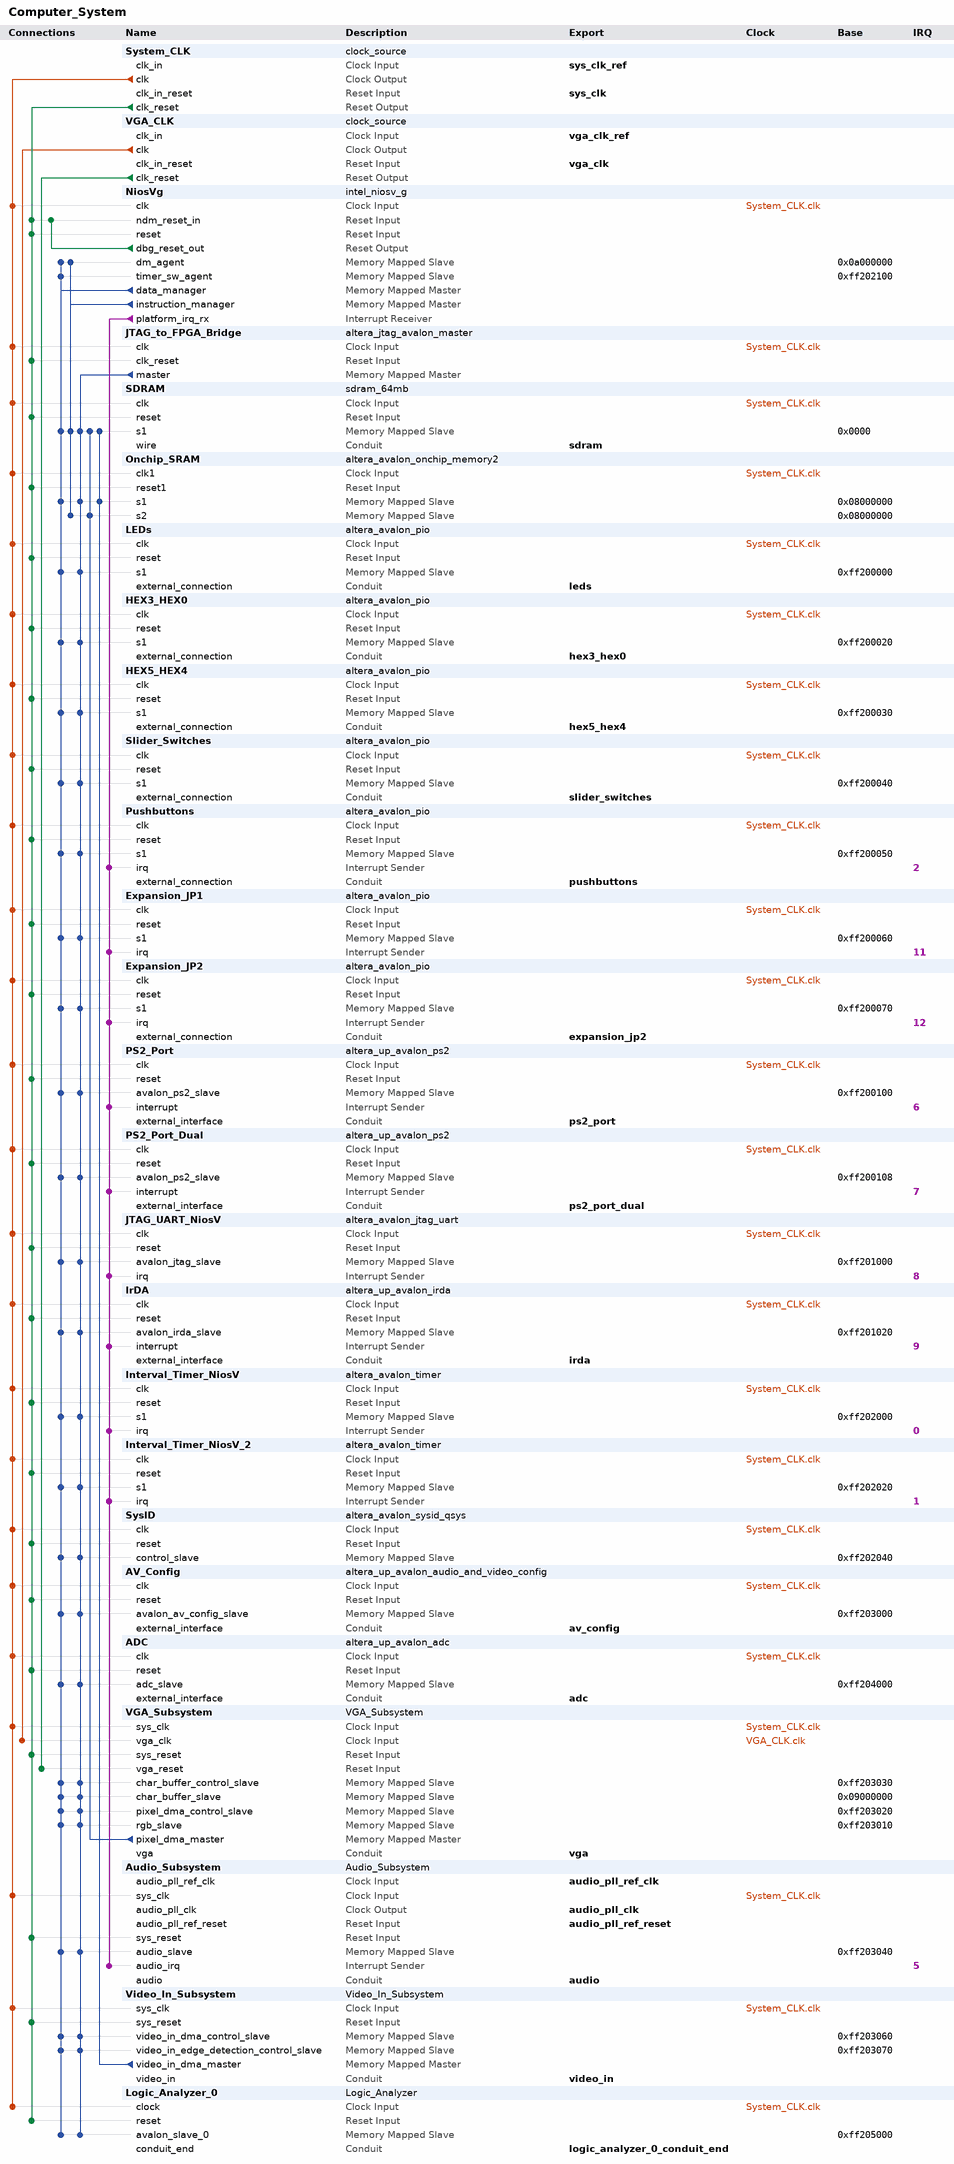
[diagram p0: system contents]
# Platform Designer (Qsys) system Computer_System, Cyclone V 5CSEMA5F31C6
# Parameters at their usual value, and those the tool derives, are not listed.
package require -exact qsys 24.1
create_system Computer_System
set_project_property DEVICE_FAMILY {Cyclone V}
set_project_property DEVICE 5CSEMA5F31C6

add_instance System_CLK clock_source 24.1
set_instance_parameter_value System_CLK clockFrequency 100000000

add_instance VGA_CLK clock_source 24.1
set_instance_parameter_value VGA_CLK clockFrequency 25000000

add_instance NiosVg intel_niosv_g 4.0.0
set_instance_parameter_value NiosVg Blind_Window_Period 1000
set_instance_parameter_value NiosVg CLICenabledInterruptMode 0
set_instance_parameter_value NiosVg CLICenabledShadowRegisterFiles 1
set_instance_parameter_value NiosVg Default_Timeout_Period 255
set_instance_parameter_value NiosVg alignCLICVectorTable 8
set_instance_parameter_value NiosVg basicInterruptMode 0
set_instance_parameter_value NiosVg basicShadowRegisterFiles 0
set_instance_parameter_value NiosVg clockFrequency 100000000
set_instance_parameter_value NiosVg dataCacheSize 1024
set_instance_parameter_value NiosVg disableFsqrtFdiv false
set_instance_parameter_value NiosVg dtcm1Base 0
set_instance_parameter_value NiosVg dtcm1Size 0
set_instance_parameter_value NiosVg dtcm2Base 0
set_instance_parameter_value NiosVg dtcm2Size 0
set_instance_parameter_value NiosVg enableBranchPrediction true
set_instance_parameter_value NiosVg enableCLICInterruptEdgeTriggerConfig false
set_instance_parameter_value NiosVg enableCLICInterruptPolarityConfig false
set_instance_parameter_value NiosVg enableCLICSelectiveHardwareVectoring false
set_instance_parameter_value NiosVg enableCoreLevelInterruptController false
set_instance_parameter_value NiosVg enableDebug true
set_instance_parameter_value NiosVg enableDebugReset true
set_instance_parameter_value NiosVg enableECCFull false
set_instance_parameter_value NiosVg enableECCLite false
set_instance_parameter_value NiosVg enableFPU true
set_instance_parameter_value NiosVg enableLockstep false
set_instance_parameter_value NiosVg enableLockstepExtRst false
set_instance_parameter_value NiosVg enableMulDiv true
set_instance_parameter_value NiosVg hartId 0
set_instance_parameter_value NiosVg instCacheSize 1024
set_instance_parameter_value NiosVg itcm1Base 0
set_instance_parameter_value NiosVg itcm1Size 0
set_instance_parameter_value NiosVg itcm2Base 0
set_instance_parameter_value NiosVg itcm2Size 0
set_instance_parameter_value NiosVg numCLICDebugTriggers 0
set_instance_parameter_value NiosVg numCLICLevels 2
set_instance_parameter_value NiosVg numCLICPlatformInterrupts 16
set_instance_parameter_value NiosVg numCLICPriorities 8
set_instance_parameter_value NiosVg peripheralRegionABase -16777216
set_instance_parameter_value NiosVg peripheralRegionASize 16777216
set_instance_parameter_value NiosVg peripheralRegionBBase 134217728
set_instance_parameter_value NiosVg peripheralRegionBSize 134217728
set_instance_parameter_value NiosVg resetOffset 0
set_instance_parameter_value NiosVg resetSlave Absolute
set_instance_parameter_value NiosVg useResetReq false

add_instance JTAG_to_FPGA_Bridge altera_jtag_avalon_master 24.1

add_instance SDRAM sdram_64mb 1.0

add_instance Onchip_SRAM altera_avalon_onchip_memory2 24.1
set_instance_parameter_value Onchip_SRAM dataWidth 32
set_instance_parameter_value Onchip_SRAM dualPort true
set_instance_parameter_value Onchip_SRAM initMemContent true
set_instance_parameter_value Onchip_SRAM initializationFileName onchip_mem.hex
set_instance_parameter_value Onchip_SRAM memorySize 262144
set_instance_parameter_value Onchip_SRAM singleClockOperation true

add_instance LEDs altera_avalon_pio 24.1
set_instance_parameter_value LEDs direction Output
set_instance_parameter_value LEDs width 10

add_instance HEX3_HEX0 altera_avalon_pio 24.1
set_instance_parameter_value HEX3_HEX0 direction Output
set_instance_parameter_value HEX3_HEX0 width 32

add_instance HEX5_HEX4 altera_avalon_pio 24.1
set_instance_parameter_value HEX5_HEX4 direction Output
set_instance_parameter_value HEX5_HEX4 width 16

add_instance Slider_Switches altera_avalon_pio 24.1
set_instance_parameter_value Slider_Switches direction Input
set_instance_parameter_value Slider_Switches simDoTestBenchWiring true
set_instance_parameter_value Slider_Switches width 10

add_instance Pushbuttons altera_avalon_pio 24.1
set_instance_parameter_value Pushbuttons bitClearingEdgeCapReg true
set_instance_parameter_value Pushbuttons captureEdge true
set_instance_parameter_value Pushbuttons direction Input
set_instance_parameter_value Pushbuttons edgeType FALLING
set_instance_parameter_value Pushbuttons generateIRQ true
set_instance_parameter_value Pushbuttons irqType EDGE
set_instance_parameter_value Pushbuttons simDoTestBenchWiring true
set_instance_parameter_value Pushbuttons width 4

add_instance Expansion_JP1 altera_avalon_pio 24.1
set_instance_parameter_value Expansion_JP1 bitClearingEdgeCapReg true
set_instance_parameter_value Expansion_JP1 captureEdge true
set_instance_parameter_value Expansion_JP1 direction Bidir
set_instance_parameter_value Expansion_JP1 edgeType FALLING
set_instance_parameter_value Expansion_JP1 generateIRQ true
set_instance_parameter_value Expansion_JP1 irqType EDGE
set_instance_parameter_value Expansion_JP1 simDoTestBenchWiring true
set_instance_parameter_value Expansion_JP1 width 32

add_instance Expansion_JP2 altera_avalon_pio 24.1
set_instance_parameter_value Expansion_JP2 bitClearingEdgeCapReg true
set_instance_parameter_value Expansion_JP2 captureEdge true
set_instance_parameter_value Expansion_JP2 direction Bidir
set_instance_parameter_value Expansion_JP2 edgeType FALLING
set_instance_parameter_value Expansion_JP2 generateIRQ true
set_instance_parameter_value Expansion_JP2 irqType EDGE
set_instance_parameter_value Expansion_JP2 simDoTestBenchWiring true
set_instance_parameter_value Expansion_JP2 width 32

add_instance PS2_Port altera_up_avalon_ps2 18.0

add_instance PS2_Port_Dual altera_up_avalon_ps2 18.0

add_instance JTAG_UART_NiosV altera_avalon_jtag_uart 24.1
set_instance_parameter_value JTAG_UART_NiosV simInteractiveOptions NO_INTERACTIVE_WINDOWS

add_instance IrDA altera_up_avalon_irda 18.0
set_instance_parameter_value IrDA baud 115200
set_instance_parameter_value IrDA parity None

add_instance Interval_Timer_NiosV altera_avalon_timer 24.1
set_instance_parameter_value Interval_Timer_NiosV period 125.0
set_instance_parameter_value Interval_Timer_NiosV periodUnits MSEC

add_instance Interval_Timer_NiosV_2 altera_avalon_timer 24.1
set_instance_parameter_value Interval_Timer_NiosV_2 period 125.0
set_instance_parameter_value Interval_Timer_NiosV_2 periodUnits MSEC

add_instance SysID altera_avalon_sysid_qsys 24.1
set_instance_parameter_value SysID id 0

add_instance AV_Config altera_up_avalon_audio_and_video_config 18.0
set_instance_parameter_value AV_Config audio_in {Microphone to ADC}
set_instance_parameter_value AV_Config bit_length 32
set_instance_parameter_value AV_Config board DE1-SoC
set_instance_parameter_value AV_Config line_in_bypass true
set_instance_parameter_value AV_Config sampling_rate {8 kHz}

add_instance ADC altera_up_avalon_adc 18.0
set_instance_parameter_value ADC board DE1-SoC
set_instance_parameter_value ADC numch_ 8

add_instance VGA_Subsystem VGA_Subsystem 1.0

add_instance Audio_Subsystem Audio_Subsystem 1.0

add_instance Video_In_Subsystem Video_In_Subsystem 1.0

add_instance Logic_Analyzer_0 Logic_Analyzer 1.0

# connections
add_connection System_CLK.clk ADC.clk clock
add_connection System_CLK.clk Audio_Subsystem.sys_clk clock
add_connection System_CLK.clk AV_Config.clk clock
add_connection System_CLK.clk Expansion_JP1.clk clock
add_connection System_CLK.clk Expansion_JP2.clk clock
add_connection System_CLK.clk HEX3_HEX0.clk clock
add_connection System_CLK.clk HEX5_HEX4.clk clock
add_connection System_CLK.clk Interval_Timer_NiosV.clk clock
add_connection System_CLK.clk Interval_Timer_NiosV_2.clk clock
add_connection System_CLK.clk IrDA.clk clock
add_connection System_CLK.clk JTAG_to_FPGA_Bridge.clk clock
add_connection System_CLK.clk JTAG_UART_NiosV.clk clock
add_connection System_CLK.clk LEDs.clk clock
add_connection System_CLK.clk Logic_Analyzer_0.clock clock
add_connection System_CLK.clk NiosVg.clk clock
add_connection System_CLK.clk Onchip_SRAM.clk1 clock
add_connection System_CLK.clk PS2_Port.clk clock
add_connection System_CLK.clk PS2_Port_Dual.clk clock
add_connection System_CLK.clk Pushbuttons.clk clock
add_connection System_CLK.clk SDRAM.clk clock
add_connection System_CLK.clk Slider_Switches.clk clock
add_connection System_CLK.clk SysID.clk clock
add_connection System_CLK.clk VGA_Subsystem.sys_clk clock
add_connection System_CLK.clk Video_In_Subsystem.sys_clk clock
add_connection VGA_CLK.clk VGA_Subsystem.vga_clk clock
add_connection NiosVg.dbg_reset_out NiosVg.ndm_reset_in reset
add_connection System_CLK.clk_reset ADC.reset reset
add_connection System_CLK.clk_reset Audio_Subsystem.sys_reset reset
add_connection System_CLK.clk_reset AV_Config.reset reset
add_connection System_CLK.clk_reset Expansion_JP1.reset reset
add_connection System_CLK.clk_reset Expansion_JP2.reset reset
add_connection System_CLK.clk_reset HEX3_HEX0.reset reset
add_connection System_CLK.clk_reset HEX5_HEX4.reset reset
add_connection System_CLK.clk_reset Interval_Timer_NiosV.reset reset
add_connection System_CLK.clk_reset Interval_Timer_NiosV_2.reset reset
add_connection System_CLK.clk_reset IrDA.reset reset
add_connection System_CLK.clk_reset JTAG_to_FPGA_Bridge.clk_reset reset
add_connection System_CLK.clk_reset JTAG_UART_NiosV.reset reset
add_connection System_CLK.clk_reset LEDs.reset reset
add_connection System_CLK.clk_reset Logic_Analyzer_0.reset reset
add_connection System_CLK.clk_reset NiosVg.ndm_reset_in reset
add_connection System_CLK.clk_reset NiosVg.reset reset
add_connection System_CLK.clk_reset Onchip_SRAM.reset1 reset
add_connection System_CLK.clk_reset PS2_Port.reset reset
add_connection System_CLK.clk_reset PS2_Port_Dual.reset reset
add_connection System_CLK.clk_reset Pushbuttons.reset reset
add_connection System_CLK.clk_reset SDRAM.reset reset
add_connection System_CLK.clk_reset Slider_Switches.reset reset
add_connection System_CLK.clk_reset SysID.reset reset
add_connection System_CLK.clk_reset VGA_Subsystem.sys_reset reset
add_connection System_CLK.clk_reset Video_In_Subsystem.sys_reset reset
add_connection VGA_CLK.clk_reset VGA_Subsystem.vga_reset reset
add_connection JTAG_to_FPGA_Bridge.master ADC.adc_slave avalon
set_connection_parameter_value JTAG_to_FPGA_Bridge.master/ADC.adc_slave baseAddress 0xff204000
add_connection JTAG_to_FPGA_Bridge.master Audio_Subsystem.audio_slave avalon
set_connection_parameter_value JTAG_to_FPGA_Bridge.master/Audio_Subsystem.audio_slave baseAddress 0xff203040
add_connection JTAG_to_FPGA_Bridge.master AV_Config.avalon_av_config_slave avalon
set_connection_parameter_value JTAG_to_FPGA_Bridge.master/AV_Config.avalon_av_config_slave baseAddress 0xff203000
add_connection JTAG_to_FPGA_Bridge.master Expansion_JP1.s1 avalon
set_connection_parameter_value JTAG_to_FPGA_Bridge.master/Expansion_JP1.s1 baseAddress 0xff200060
add_connection JTAG_to_FPGA_Bridge.master Expansion_JP2.s1 avalon
set_connection_parameter_value JTAG_to_FPGA_Bridge.master/Expansion_JP2.s1 baseAddress 0xff200070
add_connection JTAG_to_FPGA_Bridge.master HEX3_HEX0.s1 avalon
set_connection_parameter_value JTAG_to_FPGA_Bridge.master/HEX3_HEX0.s1 baseAddress 0xff200020
add_connection JTAG_to_FPGA_Bridge.master HEX5_HEX4.s1 avalon
set_connection_parameter_value JTAG_to_FPGA_Bridge.master/HEX5_HEX4.s1 baseAddress 0xff200030
add_connection JTAG_to_FPGA_Bridge.master Interval_Timer_NiosV.s1 avalon
set_connection_parameter_value JTAG_to_FPGA_Bridge.master/Interval_Timer_NiosV.s1 baseAddress 0xff202000
add_connection JTAG_to_FPGA_Bridge.master Interval_Timer_NiosV_2.s1 avalon
set_connection_parameter_value JTAG_to_FPGA_Bridge.master/Interval_Timer_NiosV_2.s1 baseAddress 0xff202020
add_connection JTAG_to_FPGA_Bridge.master IrDA.avalon_irda_slave avalon
set_connection_parameter_value JTAG_to_FPGA_Bridge.master/IrDA.avalon_irda_slave baseAddress 0xff201020
add_connection JTAG_to_FPGA_Bridge.master JTAG_UART_NiosV.avalon_jtag_slave avalon
set_connection_parameter_value JTAG_to_FPGA_Bridge.master/JTAG_UART_NiosV.avalon_jtag_slave baseAddress 0xff201000
add_connection JTAG_to_FPGA_Bridge.master LEDs.s1 avalon
set_connection_parameter_value JTAG_to_FPGA_Bridge.master/LEDs.s1 baseAddress 0xff200000
add_connection JTAG_to_FPGA_Bridge.master Logic_Analyzer_0.avalon_slave_0 avalon
set_connection_parameter_value JTAG_to_FPGA_Bridge.master/Logic_Analyzer_0.avalon_slave_0 baseAddress 0xff205000
add_connection JTAG_to_FPGA_Bridge.master Onchip_SRAM.s1 avalon
set_connection_parameter_value JTAG_to_FPGA_Bridge.master/Onchip_SRAM.s1 baseAddress 0x08000000
add_connection JTAG_to_FPGA_Bridge.master PS2_Port.avalon_ps2_slave avalon
set_connection_parameter_value JTAG_to_FPGA_Bridge.master/PS2_Port.avalon_ps2_slave baseAddress 0xff200100
add_connection JTAG_to_FPGA_Bridge.master PS2_Port_Dual.avalon_ps2_slave avalon
set_connection_parameter_value JTAG_to_FPGA_Bridge.master/PS2_Port_Dual.avalon_ps2_slave baseAddress 0xff200108
add_connection JTAG_to_FPGA_Bridge.master Pushbuttons.s1 avalon
set_connection_parameter_value JTAG_to_FPGA_Bridge.master/Pushbuttons.s1 baseAddress 0xff200050
add_connection JTAG_to_FPGA_Bridge.master SDRAM.s1 avalon
set_connection_parameter_value JTAG_to_FPGA_Bridge.master/SDRAM.s1 baseAddress 0x0000
add_connection JTAG_to_FPGA_Bridge.master Slider_Switches.s1 avalon
set_connection_parameter_value JTAG_to_FPGA_Bridge.master/Slider_Switches.s1 baseAddress 0xff200040
add_connection JTAG_to_FPGA_Bridge.master SysID.control_slave avalon
set_connection_parameter_value JTAG_to_FPGA_Bridge.master/SysID.control_slave baseAddress 0xff202040
add_connection JTAG_to_FPGA_Bridge.master VGA_Subsystem.char_buffer_control_slave avalon
set_connection_parameter_value JTAG_to_FPGA_Bridge.master/VGA_Subsystem.char_buffer_control_slave baseAddress 0xff203030
add_connection JTAG_to_FPGA_Bridge.master VGA_Subsystem.char_buffer_slave avalon
set_connection_parameter_value JTAG_to_FPGA_Bridge.master/VGA_Subsystem.char_buffer_slave baseAddress 0x09000000
add_connection JTAG_to_FPGA_Bridge.master VGA_Subsystem.pixel_dma_control_slave avalon
set_connection_parameter_value JTAG_to_FPGA_Bridge.master/VGA_Subsystem.pixel_dma_control_slave baseAddress 0xff203020
add_connection JTAG_to_FPGA_Bridge.master VGA_Subsystem.rgb_slave avalon
set_connection_parameter_value JTAG_to_FPGA_Bridge.master/VGA_Subsystem.rgb_slave baseAddress 0xff203010
add_connection JTAG_to_FPGA_Bridge.master Video_In_Subsystem.video_in_dma_control_slave avalon
set_connection_parameter_value JTAG_to_FPGA_Bridge.master/Video_In_Subsystem.video_in_dma_control_slave baseAddress 0xff203060
add_connection JTAG_to_FPGA_Bridge.master Video_In_Subsystem.video_in_edge_detection_control_slave avalon
set_connection_parameter_value JTAG_to_FPGA_Bridge.master/Video_In_Subsystem.video_in_edge_detection_control_slave baseAddress 0xff203070
add_connection NiosVg.data_manager ADC.adc_slave avalon
set_connection_parameter_value NiosVg.data_manager/ADC.adc_slave baseAddress 0xff204000
add_connection NiosVg.data_manager Audio_Subsystem.audio_slave avalon
set_connection_parameter_value NiosVg.data_manager/Audio_Subsystem.audio_slave baseAddress 0xff203040
add_connection NiosVg.data_manager AV_Config.avalon_av_config_slave avalon
set_connection_parameter_value NiosVg.data_manager/AV_Config.avalon_av_config_slave baseAddress 0xff203000
add_connection NiosVg.data_manager Expansion_JP1.s1 avalon
set_connection_parameter_value NiosVg.data_manager/Expansion_JP1.s1 baseAddress 0xff200060
add_connection NiosVg.data_manager Expansion_JP2.s1 avalon
set_connection_parameter_value NiosVg.data_manager/Expansion_JP2.s1 baseAddress 0xff200070
add_connection NiosVg.data_manager HEX3_HEX0.s1 avalon
set_connection_parameter_value NiosVg.data_manager/HEX3_HEX0.s1 baseAddress 0xff200020
add_connection NiosVg.data_manager HEX5_HEX4.s1 avalon
set_connection_parameter_value NiosVg.data_manager/HEX5_HEX4.s1 baseAddress 0xff200030
add_connection NiosVg.data_manager Interval_Timer_NiosV.s1 avalon
set_connection_parameter_value NiosVg.data_manager/Interval_Timer_NiosV.s1 baseAddress 0xff202000
add_connection NiosVg.data_manager Interval_Timer_NiosV_2.s1 avalon
set_connection_parameter_value NiosVg.data_manager/Interval_Timer_NiosV_2.s1 baseAddress 0xff202020
add_connection NiosVg.data_manager IrDA.avalon_irda_slave avalon
set_connection_parameter_value NiosVg.data_manager/IrDA.avalon_irda_slave baseAddress 0xff201020
add_connection NiosVg.data_manager JTAG_UART_NiosV.avalon_jtag_slave avalon
set_connection_parameter_value NiosVg.data_manager/JTAG_UART_NiosV.avalon_jtag_slave baseAddress 0xff201000
add_connection NiosVg.data_manager LEDs.s1 avalon
set_connection_parameter_value NiosVg.data_manager/LEDs.s1 baseAddress 0xff200000
add_connection NiosVg.data_manager Logic_Analyzer_0.avalon_slave_0 avalon
set_connection_parameter_value NiosVg.data_manager/Logic_Analyzer_0.avalon_slave_0 baseAddress 0xff205000
add_connection NiosVg.data_manager NiosVg.dm_agent avalon
set_connection_parameter_value NiosVg.data_manager/NiosVg.dm_agent baseAddress 0x0a000000
add_connection NiosVg.data_manager NiosVg.timer_sw_agent avalon
set_connection_parameter_value NiosVg.data_manager/NiosVg.timer_sw_agent baseAddress 0xff202100
add_connection NiosVg.data_manager Onchip_SRAM.s1 avalon
set_connection_parameter_value NiosVg.data_manager/Onchip_SRAM.s1 baseAddress 0x08000000
add_connection NiosVg.data_manager PS2_Port.avalon_ps2_slave avalon
set_connection_parameter_value NiosVg.data_manager/PS2_Port.avalon_ps2_slave baseAddress 0xff200100
add_connection NiosVg.data_manager PS2_Port_Dual.avalon_ps2_slave avalon
set_connection_parameter_value NiosVg.data_manager/PS2_Port_Dual.avalon_ps2_slave baseAddress 0xff200108
add_connection NiosVg.data_manager Pushbuttons.s1 avalon
set_connection_parameter_value NiosVg.data_manager/Pushbuttons.s1 baseAddress 0xff200050
add_connection NiosVg.data_manager SDRAM.s1 avalon
set_connection_parameter_value NiosVg.data_manager/SDRAM.s1 baseAddress 0x0000
add_connection NiosVg.data_manager Slider_Switches.s1 avalon
set_connection_parameter_value NiosVg.data_manager/Slider_Switches.s1 baseAddress 0xff200040
add_connection NiosVg.data_manager SysID.control_slave avalon
set_connection_parameter_value NiosVg.data_manager/SysID.control_slave baseAddress 0xff202040
add_connection NiosVg.data_manager VGA_Subsystem.char_buffer_control_slave avalon
set_connection_parameter_value NiosVg.data_manager/VGA_Subsystem.char_buffer_control_slave baseAddress 0xff203030
add_connection NiosVg.data_manager VGA_Subsystem.char_buffer_slave avalon
set_connection_parameter_value NiosVg.data_manager/VGA_Subsystem.char_buffer_slave baseAddress 0x09000000
add_connection NiosVg.data_manager VGA_Subsystem.pixel_dma_control_slave avalon
set_connection_parameter_value NiosVg.data_manager/VGA_Subsystem.pixel_dma_control_slave baseAddress 0xff203020
add_connection NiosVg.data_manager VGA_Subsystem.rgb_slave avalon
set_connection_parameter_value NiosVg.data_manager/VGA_Subsystem.rgb_slave baseAddress 0xff203010
add_connection NiosVg.data_manager Video_In_Subsystem.video_in_dma_control_slave avalon
set_connection_parameter_value NiosVg.data_manager/Video_In_Subsystem.video_in_dma_control_slave baseAddress 0xff203060
add_connection NiosVg.data_manager Video_In_Subsystem.video_in_edge_detection_control_slave avalon
set_connection_parameter_value NiosVg.data_manager/Video_In_Subsystem.video_in_edge_detection_control_slave baseAddress 0xff203070
add_connection NiosVg.instruction_manager NiosVg.dm_agent avalon
set_connection_parameter_value NiosVg.instruction_manager/NiosVg.dm_agent baseAddress 0x0a000000
add_connection NiosVg.instruction_manager Onchip_SRAM.s2 avalon
set_connection_parameter_value NiosVg.instruction_manager/Onchip_SRAM.s2 baseAddress 0x08000000
add_connection NiosVg.instruction_manager SDRAM.s1 avalon
set_connection_parameter_value NiosVg.instruction_manager/SDRAM.s1 baseAddress 0x0000
add_connection VGA_Subsystem.pixel_dma_master Onchip_SRAM.s2 avalon
set_connection_parameter_value VGA_Subsystem.pixel_dma_master/Onchip_SRAM.s2 baseAddress 0x08000000
add_connection VGA_Subsystem.pixel_dma_master SDRAM.s1 avalon
set_connection_parameter_value VGA_Subsystem.pixel_dma_master/SDRAM.s1 baseAddress 0x0000
add_connection Video_In_Subsystem.video_in_dma_master Onchip_SRAM.s1 avalon
set_connection_parameter_value Video_In_Subsystem.video_in_dma_master/Onchip_SRAM.s1 baseAddress 0x08000000
add_connection Video_In_Subsystem.video_in_dma_master SDRAM.s1 avalon
set_connection_parameter_value Video_In_Subsystem.video_in_dma_master/SDRAM.s1 baseAddress 0x0000
add_connection NiosVg.platform_irq_rx Audio_Subsystem.audio_irq interrupt
set_connection_parameter_value NiosVg.platform_irq_rx/Audio_Subsystem.audio_irq irqNumber 5
add_connection NiosVg.platform_irq_rx Expansion_JP1.irq interrupt
set_connection_parameter_value NiosVg.platform_irq_rx/Expansion_JP1.irq irqNumber 11
add_connection NiosVg.platform_irq_rx Expansion_JP2.irq interrupt
set_connection_parameter_value NiosVg.platform_irq_rx/Expansion_JP2.irq irqNumber 12
add_connection NiosVg.platform_irq_rx Interval_Timer_NiosV.irq interrupt
set_connection_parameter_value NiosVg.platform_irq_rx/Interval_Timer_NiosV.irq irqNumber 0
add_connection NiosVg.platform_irq_rx Interval_Timer_NiosV_2.irq interrupt
set_connection_parameter_value NiosVg.platform_irq_rx/Interval_Timer_NiosV_2.irq irqNumber 1
add_connection NiosVg.platform_irq_rx IrDA.interrupt interrupt
set_connection_parameter_value NiosVg.platform_irq_rx/IrDA.interrupt irqNumber 9
add_connection NiosVg.platform_irq_rx JTAG_UART_NiosV.irq interrupt
set_connection_parameter_value NiosVg.platform_irq_rx/JTAG_UART_NiosV.irq irqNumber 8
add_connection NiosVg.platform_irq_rx PS2_Port.interrupt interrupt
set_connection_parameter_value NiosVg.platform_irq_rx/PS2_Port.interrupt irqNumber 6
add_connection NiosVg.platform_irq_rx PS2_Port_Dual.interrupt interrupt
set_connection_parameter_value NiosVg.platform_irq_rx/PS2_Port_Dual.interrupt irqNumber 7
add_connection NiosVg.platform_irq_rx Pushbuttons.irq interrupt
set_connection_parameter_value NiosVg.platform_irq_rx/Pushbuttons.irq irqNumber 2

# exported interfaces
add_interface adc conduit end
set_interface_property adc EXPORT_OF ADC.external_interface
add_interface audio conduit end
set_interface_property audio EXPORT_OF Audio_Subsystem.audio
add_interface audio_pll_clk clock source
set_interface_property audio_pll_clk EXPORT_OF Audio_Subsystem.audio_pll_clk
add_interface audio_pll_ref_clk clock sink
set_interface_property audio_pll_ref_clk EXPORT_OF Audio_Subsystem.audio_pll_ref_clk
add_interface audio_pll_ref_reset reset sink
set_interface_property audio_pll_ref_reset EXPORT_OF Audio_Subsystem.audio_pll_ref_reset
add_interface av_config conduit end
set_interface_property av_config EXPORT_OF AV_Config.external_interface
add_interface expansion_jp2 conduit end
set_interface_property expansion_jp2 EXPORT_OF Expansion_JP2.external_connection
add_interface hex3_hex0 conduit end
set_interface_property hex3_hex0 EXPORT_OF HEX3_HEX0.external_connection
add_interface hex5_hex4 conduit end
set_interface_property hex5_hex4 EXPORT_OF HEX5_HEX4.external_connection
add_interface irda conduit end
set_interface_property irda EXPORT_OF IrDA.external_interface
add_interface leds conduit end
set_interface_property leds EXPORT_OF LEDs.external_connection
add_interface logic_analyzer_0_conduit_end conduit end
set_interface_property logic_analyzer_0_conduit_end EXPORT_OF Logic_Analyzer_0.conduit_end
add_interface ps2_port conduit end
set_interface_property ps2_port EXPORT_OF PS2_Port.external_interface
add_interface ps2_port_dual conduit end
set_interface_property ps2_port_dual EXPORT_OF PS2_Port_Dual.external_interface
add_interface pushbuttons conduit end
set_interface_property pushbuttons EXPORT_OF Pushbuttons.external_connection
add_interface sdram conduit end
set_interface_property sdram EXPORT_OF SDRAM.wire
add_interface slider_switches conduit end
set_interface_property slider_switches EXPORT_OF Slider_Switches.external_connection
add_interface sys_clk reset sink
set_interface_property sys_clk EXPORT_OF System_CLK.clk_in_reset
add_interface sys_clk_ref clock sink
set_interface_property sys_clk_ref EXPORT_OF System_CLK.clk_in
add_interface vga conduit end
set_interface_property vga EXPORT_OF VGA_Subsystem.vga
add_interface vga_clk reset sink
set_interface_property vga_clk EXPORT_OF VGA_CLK.clk_in_reset
add_interface vga_clk_ref clock sink
set_interface_property vga_clk_ref EXPORT_OF VGA_CLK.clk_in
add_interface video_in conduit end
set_interface_property video_in EXPORT_OF Video_In_Subsystem.video_in

set_interconnect_requirement {$system} qsys_mm.clockCrossingAdapter HANDSHAKE
set_interconnect_requirement {$system} qsys_mm.enableEccProtection FALSE
set_interconnect_requirement {$system} qsys_mm.insertDefaultSlave FALSE
set_interconnect_requirement {$system} qsys_mm.maxAdditionalLatency 1

save_system Computer_System.qsys
